# EAGLE schematic sensorSchematic (EAGLE 7.6.0)
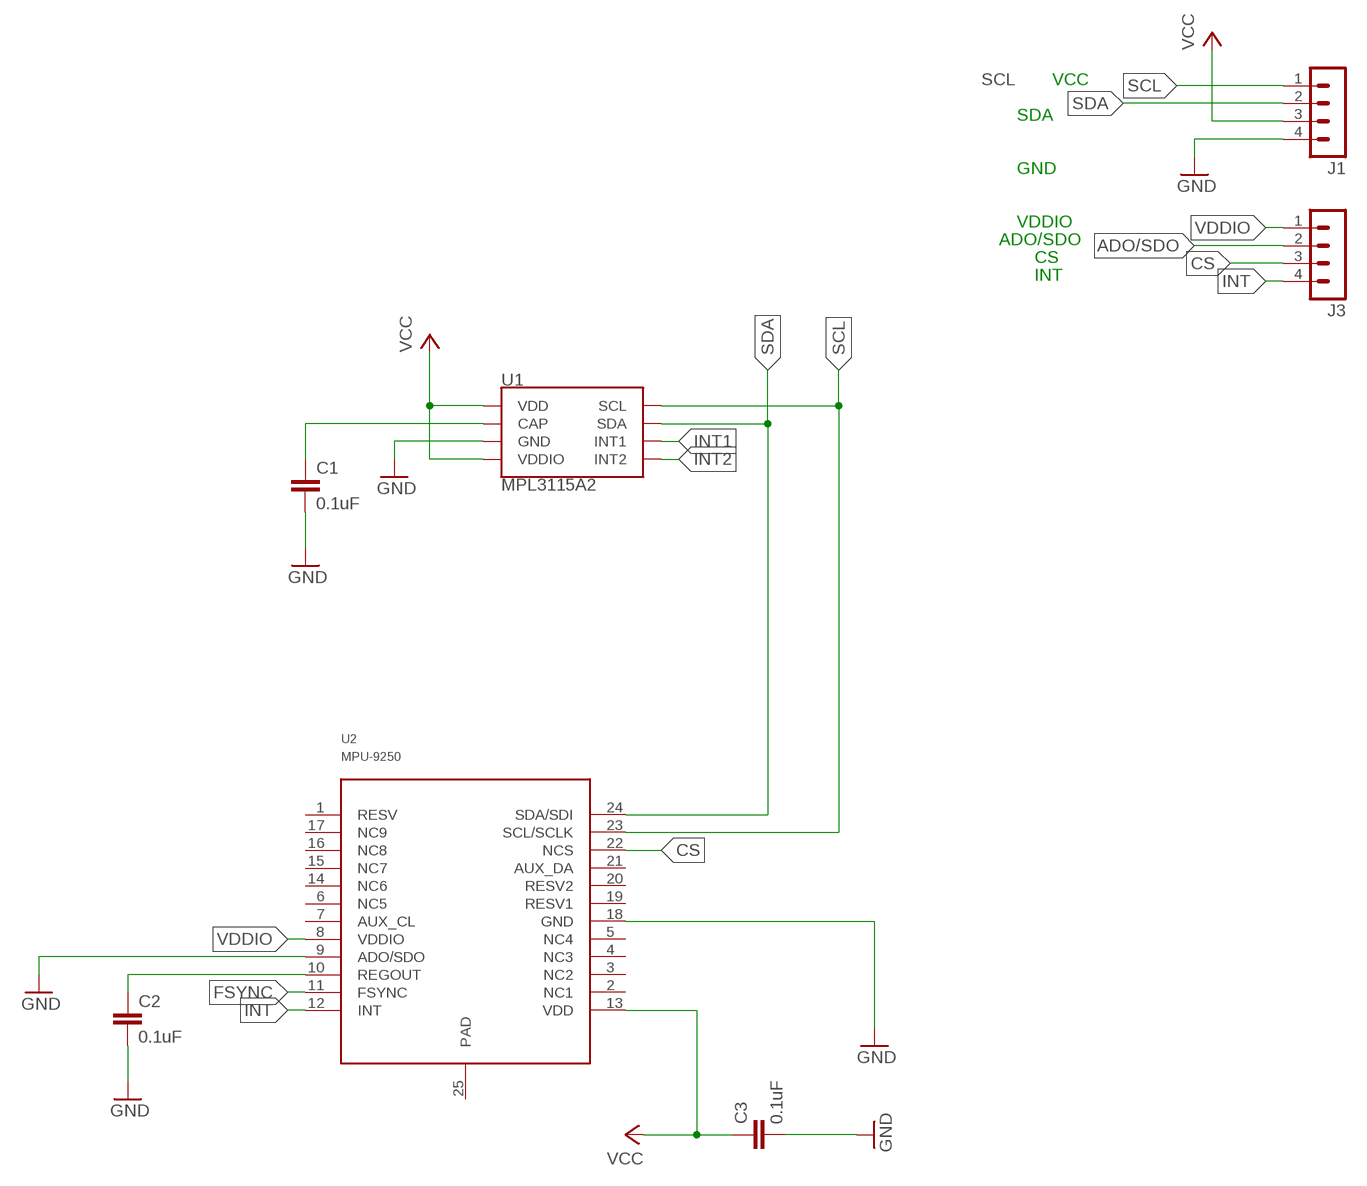
[diagram p0: schematic, sheet 1]

## Parts
C1  0.1uF  0.1UF-0402-16V-10%  [0402]
C2  0.1uF  0.1UF-0402-16V-10%  [0402]
C3  0.1uF  0.1UF-0402-16V-10%  [0402]
J1  MA04-1  [MA04-1]
J3  MA04-1  [MA04-1]
U1  MPL3115A2  [LGA-8]
U2  MPU-9250  [LEAD-QFN24]

## Nets
ADO/SDO: J3.2
CS: J3.3 U2.22(NCS)
FSYNC: U2.11(FSYNC)
GND: C1.2 C2.2 C3.2 J1.4 U1.3(GND) U2.9(ADO/SDO) U2.18(GND)
INT: J3.4 U2.12(INT)
INT1: U1.6(INT1)
INT2: U1.5(INT2)
N$1: C1.1 U1.2(CAP)
N$3: C2.1 U2.10(REGOUT)
SCL: J1.1 U1.8(SCL) U2.23(SCL/SCLK)
SDA: J1.2 U1.7(SDA) U2.24(SDA/SDI)
VCC: C3.1 J1.3 U1.1(VDD) U1.4(VDDIO) U2.13(VDD)
VDDIO: J3.1 U2.8(VDDIO)
Unconnected: U2.1(RESV) U2.2(NC1) U2.3(NC2) U2.4(NC3) U2.5(NC4) U2.6(NC5) U2.7(AUX_CL) U2.14(NC6) U2.15(NC7) U2.16(NC8) U2.17(NC9) U2.19(RESV1) U2.20(RESV2) U2.21(AUX_DA) U2.25(PAD)

## Notes on the sheet
- SCL | VCC
- SDA
- GND
- VDDIO
- ADO/SDO
- CS
- INT

## Library data of the parts
C1-C3 = SparkFun-Capacitors:0.1UF: 0.1µF ceramic capacitors A capacitor is a passive two-terminal electrical component used to store electrical energy temporarily in an electric field.; PROD_ID: CAP-12416
J1 J3 = con-lstb:MA04-1: PIN HEADER; OC_FARNELL: unknown; OC_NEWARK: unknown
U1 = SparkFun-Sensors:MPL3115A2: NXP MPL3115A2 Digital Altimeter/Pressure Sensor The MPL3115A2 is a compact piezoresistive absolute pressure sensor with an I2C interface. MPL3115 has a wide operating range of 20kPa to 110 kPa, a range that covers all surface elevations on Earth. The fully internally compensated MEMS in conjunction with an embedded high resolution 24-bit equivalent ADC provide accurate pressure [Pascals] /altitude [meters] and temperature [degrees Celsius] data. Datasheet <http://cdn.sparkfun.com/datasheets/Sensors/Pressure/MPL3115A2.pdf> SparkFun Products SparkFun Altitude/Pressure Sensor Breakout - MPL3115A2 <https://www.sparkfun.com/products/11084> (SEN-11084) SparkFun Weather Shield <https://www.sparkfun.com/products/12081> (DEV-12081) SparkFun Photon Weather Shield <https://www.sparkfun.com/products/13630> (DEV-13630); PROD_ID: IC-10869
U2 = invensense copy:MPU-9250

## Module J1
Ports: 

### Library data of the parts